# Altium project PCB_Project.PrjPcb
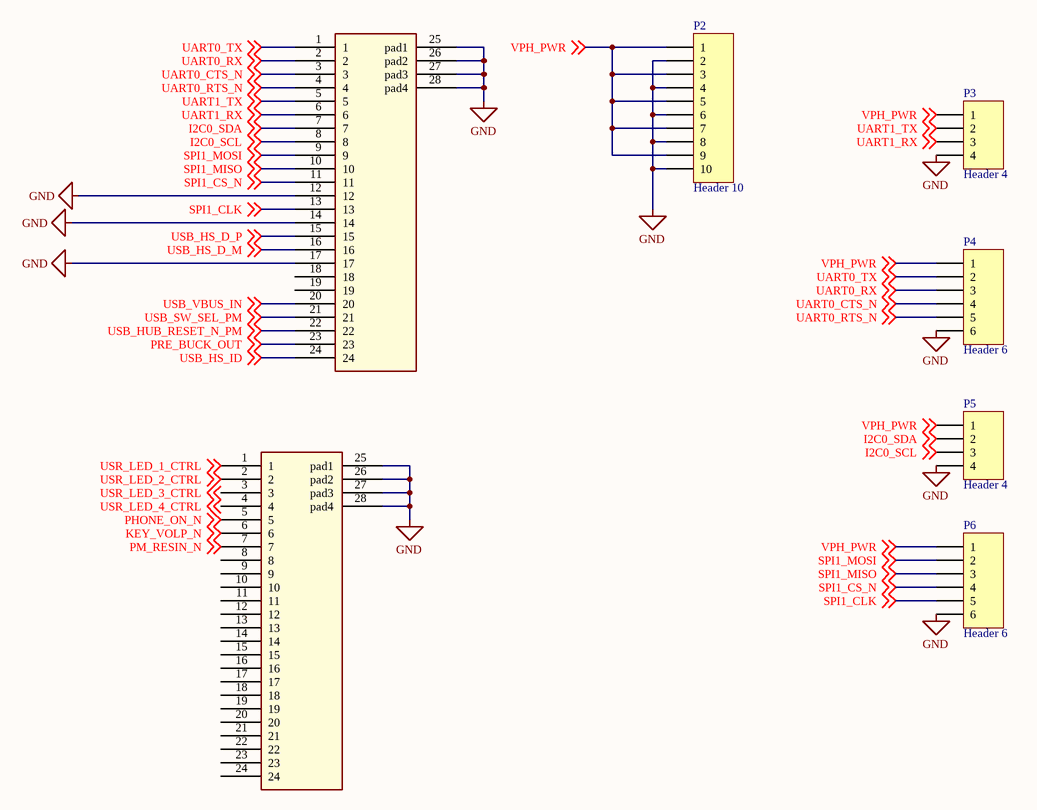
[diagram p0: INTERFACE_PWR_LS_HS.SchDoc]
3 sheets, 106 parts. Net scope: global (net labels, ports and power ports of the same name join across sheets).
Sheets:
  INTERFACE_PWR_LS_HS.SchDoc
  PWR_BUCK.SchDoc
  USB_HUB.SchDoc

## Sheet INTERFACE_PWR_LS_HS.SchDoc
size A4

### Parts
CN1  CON24_0  (value not drawn)
CN2  CON24_0  (value not drawn)
P2  Header 10  [HDR1X10]
P3  Header 4  [HDR1X4]
P4  Header 6  [HDR1X6]
P5  Header 4  [HDR1X4]
P6  Header 6  [HDR1X6]

### Nets
GND: CN1.12 CN1.14 CN1.17 CN1.25(pad1) CN1.26(pad2) CN1.27(pad3) CN1.28(pad4) CN2.25(pad1) CN2.26(pad2) CN2.27(pad3) CN2.28(pad4) P2.2 P2.4 P2.6 P2.8 P2.10 P3.4 P4.6 P5.4 P6.6
I2C0_SCL: CN1.8 P5.3 ; off-sheet I2C0_SCL
I2C0_SDA: CN1.7 P5.2 ; off-sheet I2C0_SDA
KEY_VOLP_N: CN2.6 ; off-sheet KEY_VOLP_N
PHONE_ON_N: CN2.5 ; off-sheet PHONE_ON_N
PM_RESIN_N: CN2.7 ; off-sheet PM_RESIN_N
PRE_BUCK_OUT: CN1.23 ; off-sheet PRE_BUCK_OUT
SPI1_CLK: CN1.13 P6.5 ; off-sheet SPI1_CLK
SPI1_CS_N: CN1.11 P6.4 ; off-sheet SPI1_CS_N
SPI1_MISO: CN1.10 P6.3 ; off-sheet SPI1_MISO
SPI1_MOSI: CN1.9 P6.2 ; off-sheet SPI1_MOSI
UART0_CTS_N: CN1.3 P4.4 ; off-sheet UART0_CTS_N
UART0_RTS_N: CN1.4 P4.5 ; off-sheet UART0_RTS_N
UART0_RX: CN1.2 P4.3 ; off-sheet UART0_RX
UART0_TX: CN1.1 P4.2 ; off-sheet UART0_TX
UART1_RX: CN1.6 P3.3 ; off-sheet UART1_RX
UART1_TX: CN1.5 P3.2 ; off-sheet UART1_TX
USB_HS_D_M: CN1.16 ; off-sheet USB_HS_D_M
USB_HS_D_P: CN1.15 ; off-sheet USB_HS_D_P
USB_HS_ID: CN1.24 ; off-sheet USB_HS_ID
USB_HUB_RESET_N_PM: CN1.22 ; off-sheet USB_HUB_RESET_N_PM
USB_SW_SEL_PM: CN1.21 ; off-sheet USB_SW_SEL_PM
USB_VBUS_IN: CN1.20 ; off-sheet USB_VBUS_IN
USR_LED_1_CTRL: CN2.1 ; off-sheet USR_LED_1_CTRL
USR_LED_2_CTRL: CN2.2 ; off-sheet USR_LED_2_CTRL
USR_LED_3_CTRL: CN2.3 ; off-sheet USR_LED_3_CTRL
USR_LED_4_CTRL: CN2.4 ; off-sheet USR_LED_4_CTRL
VPH_PWR: P2.1 P2.3 P2.5 P2.7 P2.9 P3.1 P4.1 P5.1 P6.1 ; off-sheet VPH_PWR

Not connected (* = marked no-connect by the designer): CN1 18 19; CN2 8 9 10 11 12 13 14 15 16 17 18 19 20 21 22 23 24

### Library data of the parts
P2 = Header 10: Header, 10-Pin; LatestRevisionDate: 17-Jul-2002; LatestRevisionNote: Re-released for DXP Platform.; Publisher: Altium Limited
P3 P5 = Header 4: Header, 4-Pin; LatestRevisionDate: 17-Jul-2002; LatestRevisionNote: Re-released for DXP Platform.; Publisher: Altium Limited
P4 P6 = Header 6: Header, 6-Pin; LatestRevisionDate: 17-Jul-2002; LatestRevisionNote: Re-released for DXP Platform.; Publisher: Altium Limited

## Sheet PWR_BUCK.SchDoc
size A4
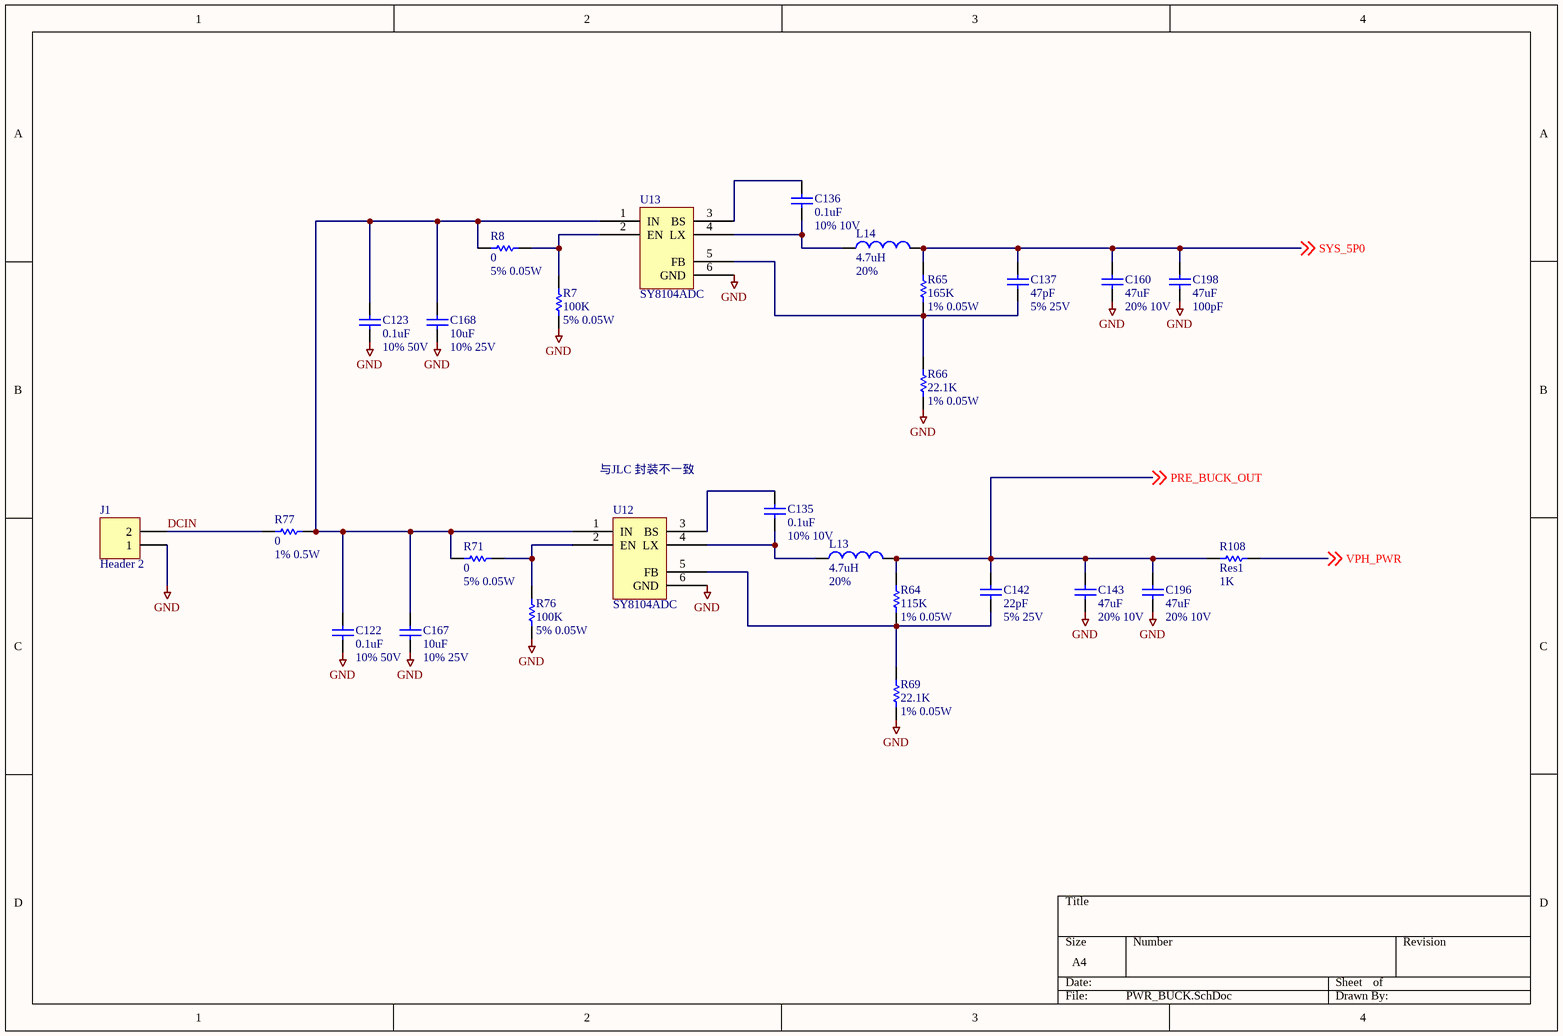
[diagram p1: PWR_BUCK.SchDoc]

### Parts
C122  0.1uF  value 10% 50V  [RAD-0.3]
C123  0.1uF  value 10% 50V  [RAD-0.3]
C135  0.1uF  value 10% 10V  [RAD-0.3]
C136  0.1uF  value 10% 10V  [RAD-0.3]
C137  47pF  value 5% 25V  [RAD-0.3]
C142  22pF  value 5% 25V  [RAD-0.3]
C143  47uF  value 20% 10V  [RAD-0.3]
C160  47uF  value 20% 10V  [RAD-0.3]
C167  10uF  value 10% 25V  [RAD-0.3]
C168  10uF  value 10% 25V  [RAD-0.3]
C196  47uF  value 20% 10V  [RAD-0.3]
C198  47uF  value 100pF  [RAD-0.3]
J1  Header 2  [HDR1X2]
L13  4.7uH  value 20%  [0402-A]
L14  4.7uH  value 20%  [0402-A]
R7  100K  value 5% 0.05W  [AXIAL-0.3]
R8  0  value 5% 0.05W  [AXIAL-0.3]
R64  115K  value 1% 0.05W  [AXIAL-0.3]
R65  165K  value 1% 0.05W  [AXIAL-0.3]
R66  22.1K  value 1% 0.05W  [AXIAL-0.3]
R69  22.1K  value 1% 0.05W  [AXIAL-0.3]
R71  0  value 5% 0.05W  [AXIAL-0.3]
R76  100K  value 5% 0.05W  [AXIAL-0.3]
R77  0  value 1% 0.5W  [AXIAL-0.3]
R108  Res1  value 1K  [AXIAL-0.3]
U12  SY8104ADC
U13  SY8104ADC

### Nets
GND: C122.1 C123.1 C143.1 C160.1 C167.1 C168.1 C196.1 C198.1 J1.1 R7.1 R66.1 R69.1 R76.1 U12.6(GND) U13.6(GND)
DCIN: J1.2 R77.1
PRE_BUCK_OUT: C142.2 C143.2 C196.2 L13.2 R64.2 R108.1 ; off-sheet PRE_BUCK_OUT
SYS_5P0: C137.2 C160.2 C198.2 L14.2 R65.2 ; off-sheet SYS_5P0
VPH_PWR: R108.2 ; off-sheet VPH_PWR
NetC122_2: C122.2 C123.2 C167.2 C168.2 R8.1 R71.1 R77.2 U12.1(IN) U13.1(IN)
NetC135_1: C135.1 L13.1 U12.4(LX)
NetC135_2: C135.2 U12.3(BS)
NetC136_1: C136.1 L14.1 U13.4(LX)
NetC136_2: C136.2 U13.3(BS)
NetC137_1: C137.1 R65.1 R66.2 U13.5(FB)
NetC142_1: C142.1 R64.1 R69.2 U12.5(FB)
NetR7_2: R7.2 R8.2 U13.2(EN)
NetR71_2: R71.2 R76.2 U12.2(EN)

### Notes on the sheet
- 与JLC 封装不一致

### Library data of the parts
C122 C123 C135-C137 C142 C143 C160 C167 C168 C196 C198 = Cap: Capacitor; Published: 8-Jun-2000; LatestRevisionDate: 17-Jul-2002; LatestRevisionNote: Re-released for DXP Platform.; PackageReference: RAD-0.3; Publisher: Altium Limited; PackageDescription: Radial Cap, Thru-Hole; 2 Leads; 0.3 in Pin Spacing
J1 = Header 2: Header, 2-Pin; LatestRevisionDate: 17-Jul-2002; LatestRevisionNote: Re-released for DXP Platform.; Publisher: Altium Limited
L13 L14 = Inductor: Code_IEC: 1005; Published: 8-Jun-2000; LatestRevisionDate: 29-May-2009; LatestRevisionNote: IPC-7351 Footprint Added.; PackageReference: 0402-A; Publisher: Altium Limited; PackageDescription: Chip Inductor; Code_JEITA: 0402
R7 R8 R64-R66 R69 R71 R76 R77 R108 = Res1: Resistor; Published: 8-Jun-2000; LatestRevisionDate: 17-Jul-2002; LatestRevisionNote: Re-released for DXP Platform.; PackageReference: AXIAL-0.3; Publisher: Altium Limited; PackageDescription: Axial Device, Thru-Hole; 2 Leads; 0.3 in Pin Spacing

## Sheet USB_HUB.SchDoc
size A0
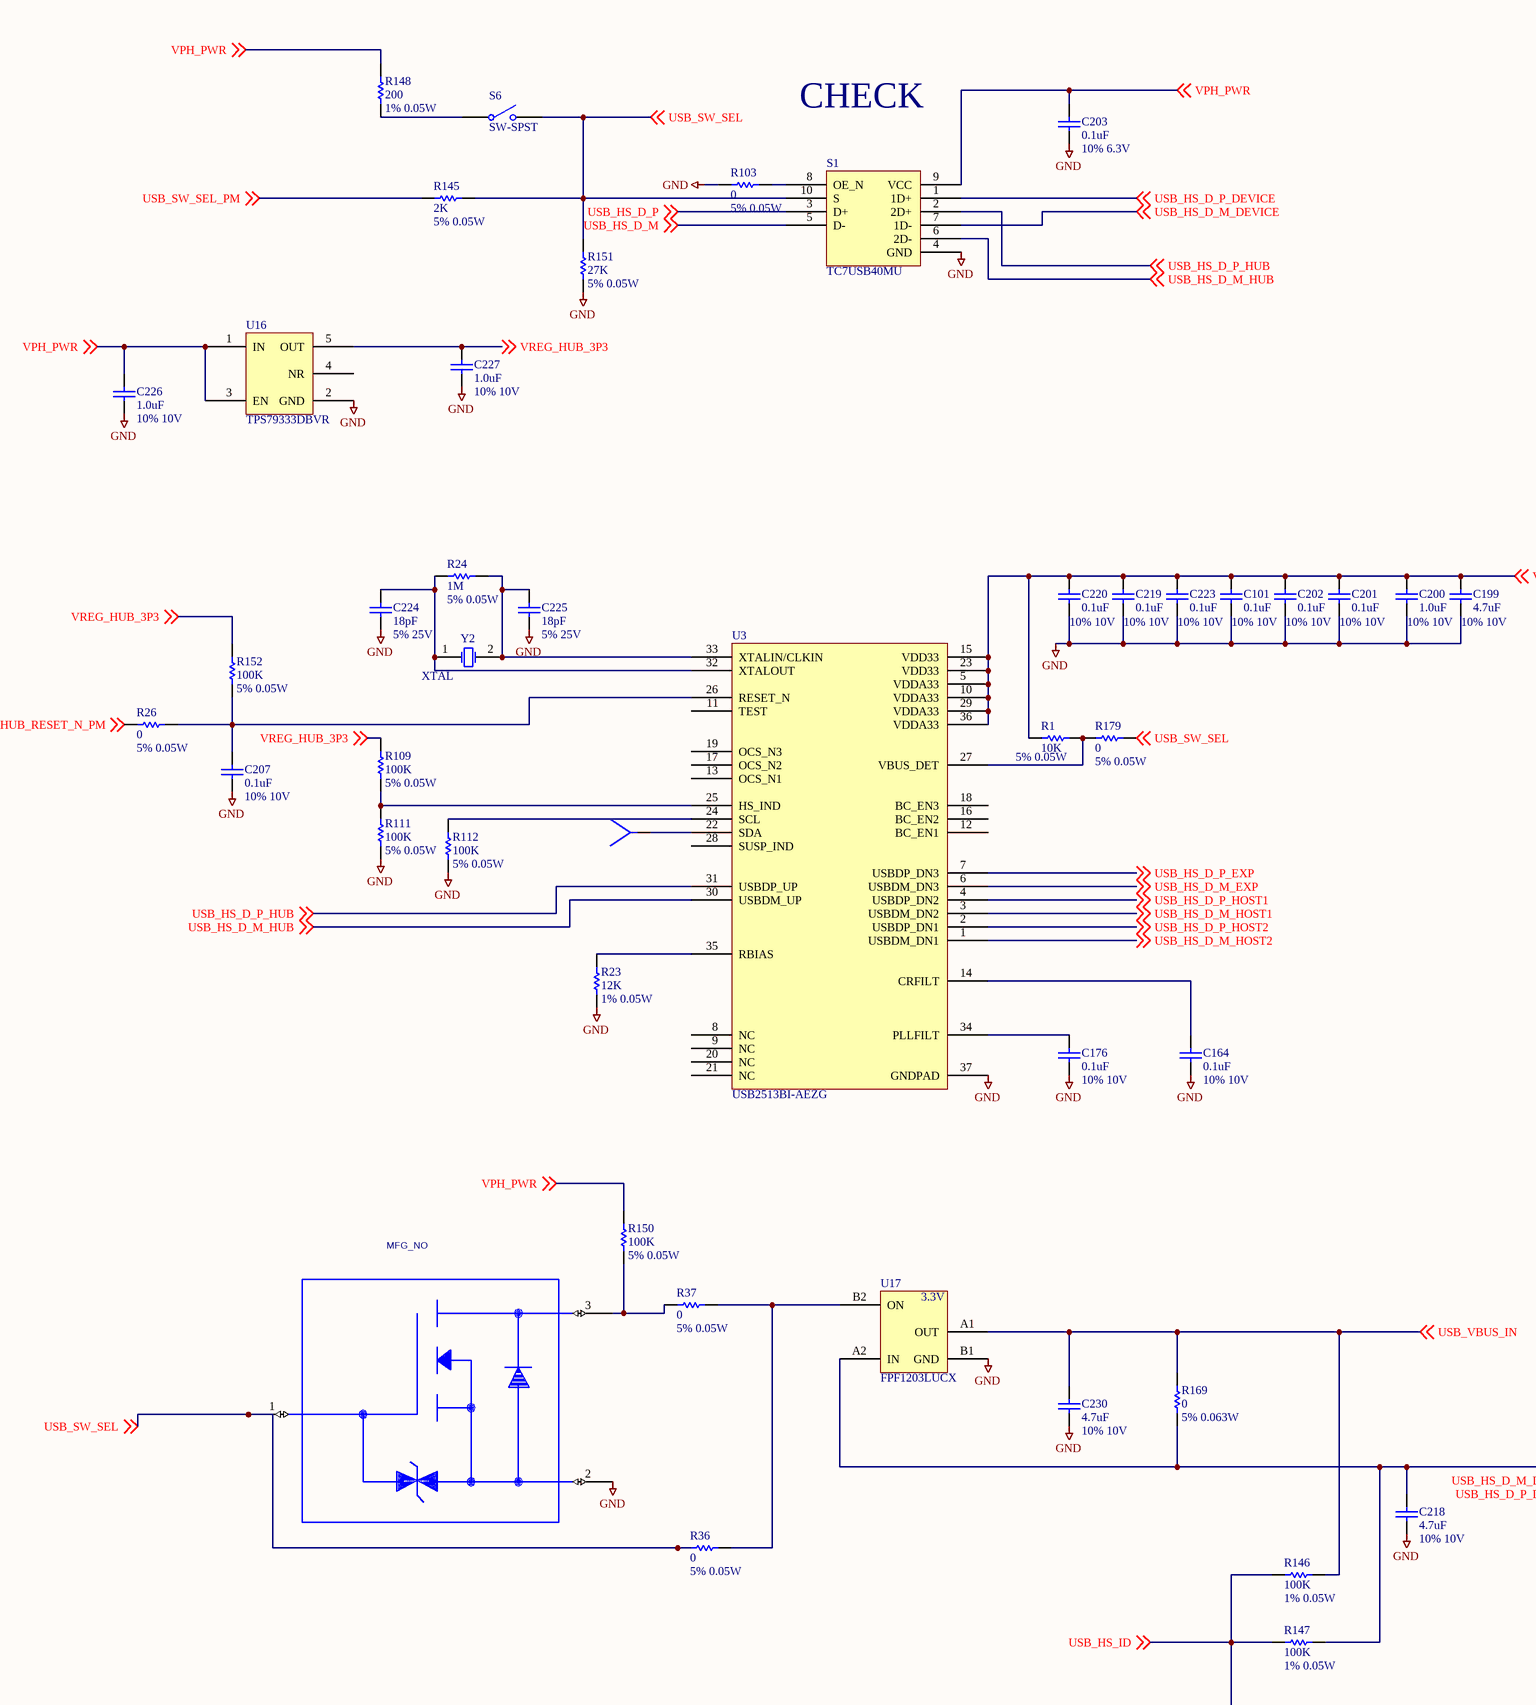
[diagram p2: USB_HUB.SchDoc, top left]
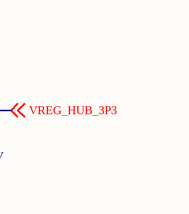
[diagram p3: USB_HUB.SchDoc, top right]
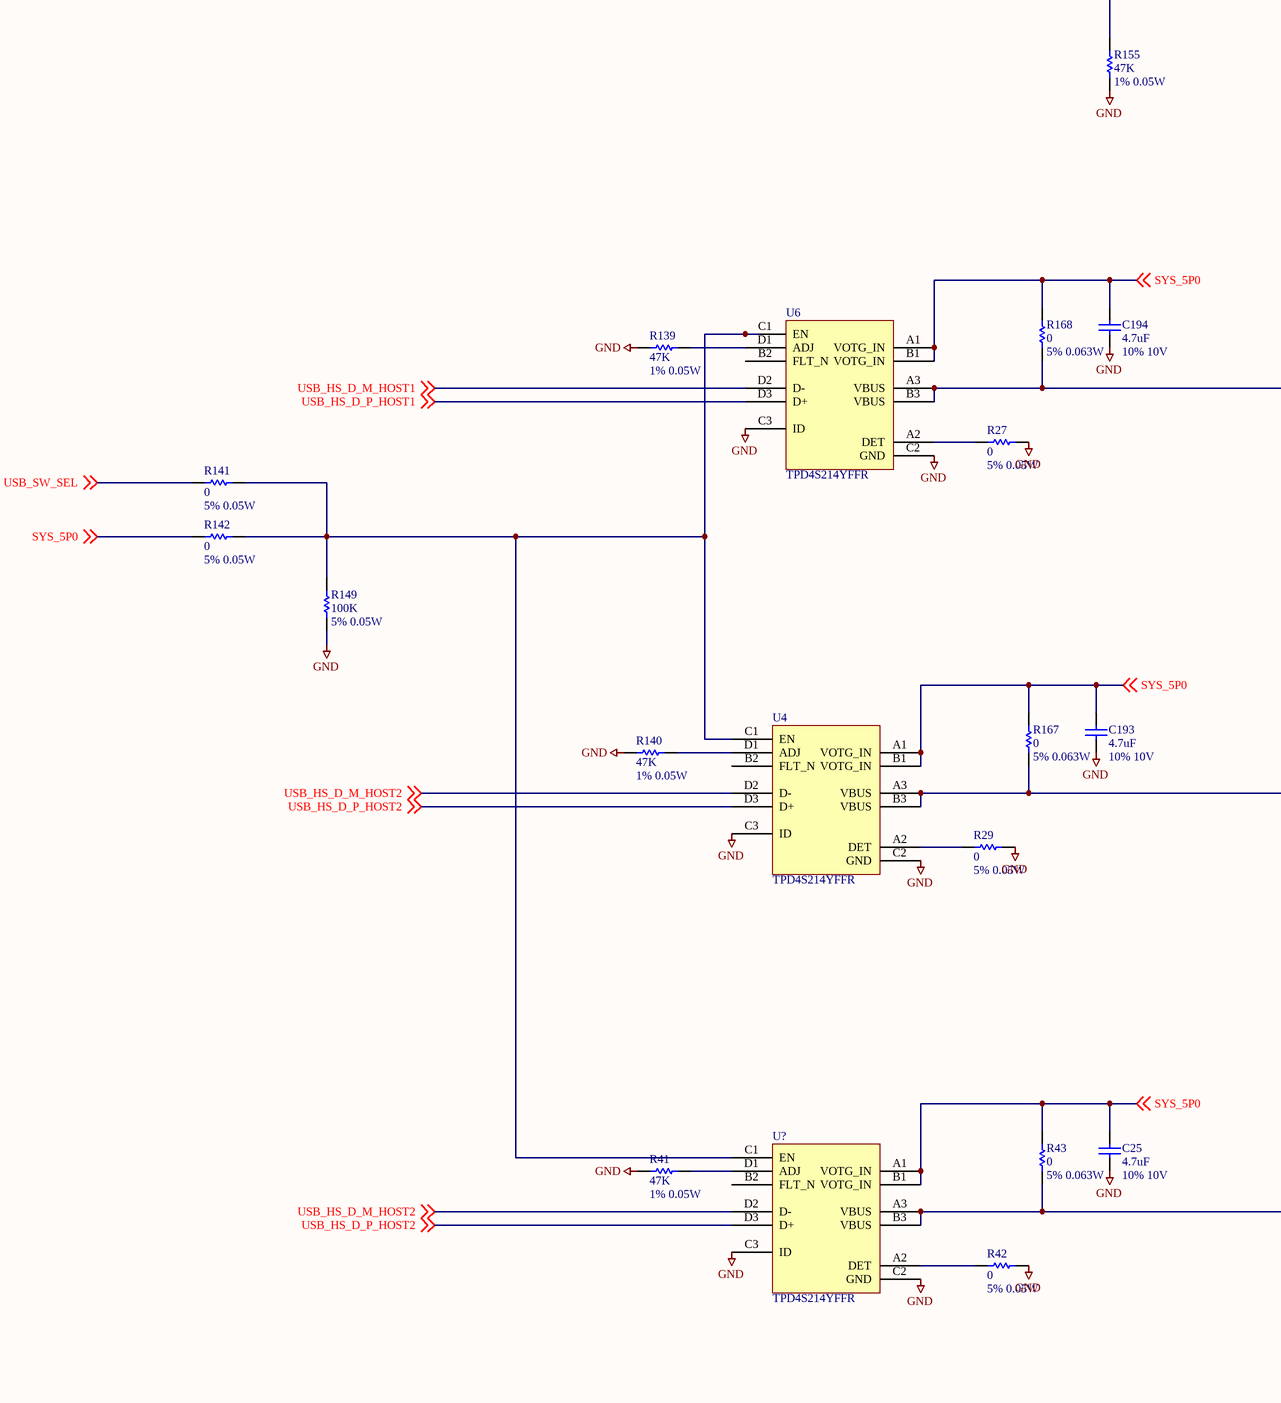
[diagram p4: USB_HUB.SchDoc, bottom left]
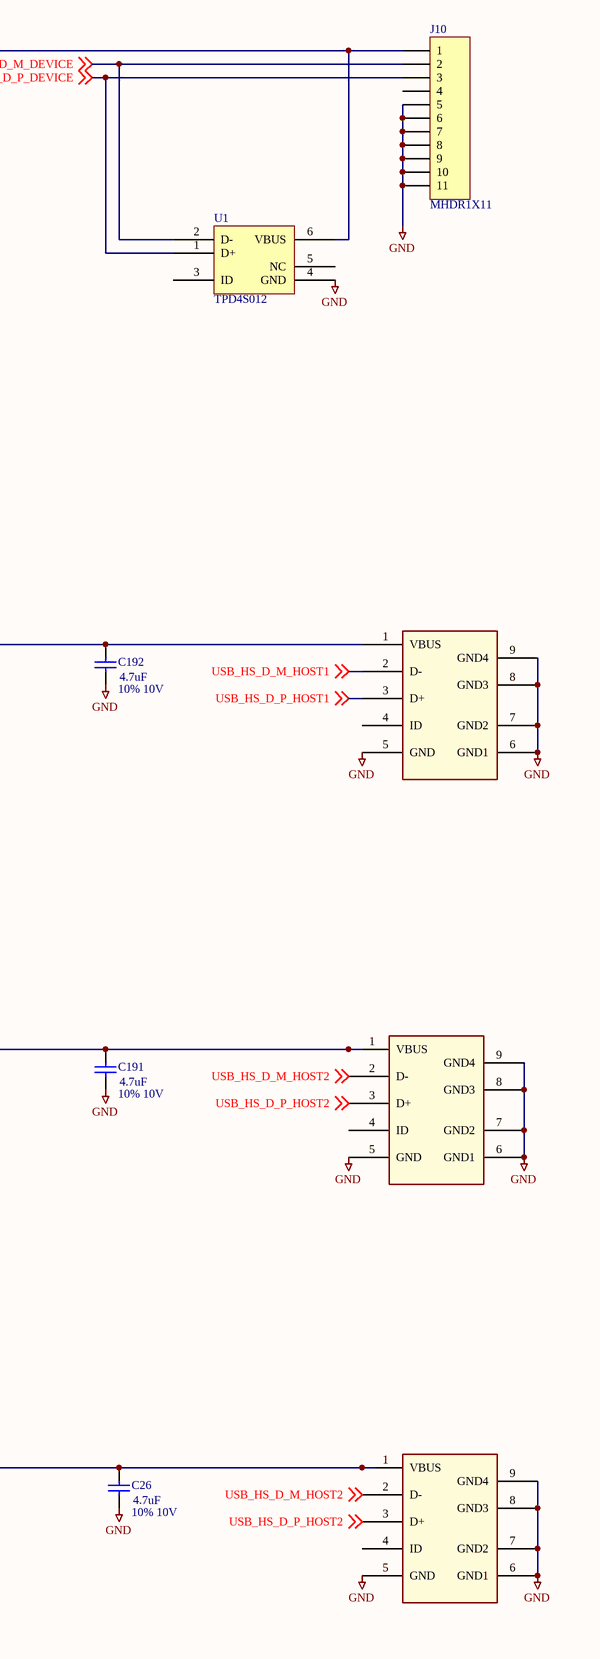
[diagram p5: USB_HUB.SchDoc, bottom right]

### Parts
C25  4.7uF  value 10% 10V  [RAD-0.3]
C26  4.7uF  value 10% 10V  [RAD-0.3]
C101  0.1uF  value 10% 10V  [RAD-0.3]
C164  0.1uF  value 10% 10V  [RAD-0.3]
C176  0.1uF  value 10% 10V  [RAD-0.3]
C191  4.7uF  value 10% 10V  [RAD-0.3]
C192  4.7uF  value 10% 10V  [RAD-0.3]
C193  4.7uF  value 10% 10V  [RAD-0.3]
C194  4.7uF  value 10% 10V  [RAD-0.3]
C199  4.7uF  value 10% 10V  [RAD-0.3]
C200  1.0uF  value 10% 10V  [RAD-0.3]
C201  0.1uF  value 10% 10V  [RAD-0.3]
C202  0.1uF  value 10% 10V  [RAD-0.3]
C203  0.1uF  value 10% 6.3V  [RAD-0.3]
C207  0.1uF  value 10% 10V  [RAD-0.3]
C218  4.7uF  value 10% 10V  [RAD-0.3]
C219  0.1uF  value 10% 10V  [RAD-0.3]
C220  0.1uF  value 10% 10V  [RAD-0.3]
C223  0.1uF  value 10% 10V  [RAD-0.3]
C224  18pF  value 5% 25V  [RAD-0.3]
C225  18pF  value 5% 25V  [RAD-0.3]
C226  1.0uF  value 10% 10V  [RAD-0.3]
C227  1.0uF  value 10% 10V  [RAD-0.3]
C230  4.7uF  value 10% 10V  [RAD-0.3]
J2  USB_SOCKET  (value not drawn)
J3  USB_SOCKET  (value not drawn)
J10  MHDR1X11  [MHDR1X11]
J?  USB_SOCKET  (value not drawn)
Q?  PART_ID: MFG_NO  (hidden comment: nfet_zener_bidir)
R1  10K  value 5% 0.05W  [AXIAL-0.3]
R23  12K  value 1% 0.05W  [AXIAL-0.3]
R24  1M  value 5% 0.05W  [AXIAL-0.3]
R26  0  value 5% 0.05W  [AXIAL-0.3]
R27  0  value 5% 0.05W  [AXIAL-0.3]
R29  0  value 5% 0.05W  [AXIAL-0.3]
R36  0  value 5% 0.05W  [AXIAL-0.3]
R37  0  value 5% 0.05W  [AXIAL-0.3]
R41  47K  value 1% 0.05W  [AXIAL-0.3]
R42  0  value 5% 0.05W  [AXIAL-0.3]
R43  0  value 5% 0.063W  [AXIAL-0.3]
R103  0  value 5% 0.05W  [AXIAL-0.3]
R109  100K  value 5% 0.05W  [AXIAL-0.3]
R111  100K  value 5% 0.05W  [AXIAL-0.3]
R112  100K  value 5% 0.05W  [AXIAL-0.3]
R139  47K  value 1% 0.05W  [AXIAL-0.3]
R140  47K  value 1% 0.05W  [AXIAL-0.3]
R141  0  value 5% 0.05W  [AXIAL-0.3]
R142  0  value 5% 0.05W  [AXIAL-0.3]
R145  2K  value 5% 0.05W  [AXIAL-0.3]
R146  100K  value 1% 0.05W  [AXIAL-0.3]
R147  100K  value 1% 0.05W  [AXIAL-0.3]
R148  200  value 1% 0.05W  [AXIAL-0.3]
R149  100K  value 5% 0.05W  [AXIAL-0.3]
R150  100K  value 5% 0.05W  [AXIAL-0.3]
R151  27K  value 5% 0.05W  [AXIAL-0.3]
R152  100K  value 5% 0.05W  [AXIAL-0.3]
R155  47K  value 1% 0.05W  [AXIAL-0.3]
R167  0  value 5% 0.063W  [AXIAL-0.3]
R168  0  value 5% 0.063W  [AXIAL-0.3]
R169  0  value 5% 0.063W  [AXIAL-0.3]
R179  0  value 5% 0.05W  [AXIAL-0.3]
S1  TC7USB40MU
S6  SW-SPST  [SPST-2]
TP18  TP  (value not drawn)
U1  TPD4S012
U3  USB2513BI-AEZG
U4  TPD4S214YFFR
U6  TPD4S214YFFR
U16  TPS79333DBVR
U17  FPF1203LUCX
U?  TPD4S214YFFR
Y2  XTAL  [R38]

### Nets
GND: C25.1 C26.2 C101.1 C164.1 C176.1 C191.2 C192.2 C193.1 C194.1 C199.1 C200.1 C201.1 C202.1 C203.2 C207.1 C218.1 C219.1 C220.1 C223.1 C224.1 C225.1 C226.1 C227.1 C230.1 J2.5(GND) J2.6(GND1) J2.7(GND2) J2.8(GND3) J2.9(GND4) J3.5(GND) J3.6(GND1) J3.7(GND2) J3.8(GND3) J3.9(GND4) J10.5 J10.6 J10.7 J10.8 J10.9 J10.10 J10.11 J?.5(GND) J?.6(GND1) J?.7(GND2) J?.8(GND3) J?.9(GND4) Q?.2(S) R23.1 R27.2 R29.2 R41.1 R42.2 R103.1 R111.1 R112.1 R139.1 R140.1 R149.1 R151.1 R155.1 S1.4(GND) U1.4(GND) U3.37(GNDPAD) U4.C2(GND) U4.C3(ID) U6.C2(GND) U6.C3(ID) U16.2(GND) U17.B1(GND) U?.C2(GND) U?.C3(ID)
SYS_5P0: C25.2 C193.2 C194.2 R43.2 R142.1 R167.2 R168.2 U4.A1(VOTG_IN) U4.B1(VOTG_IN) U6.A1(VOTG_IN) U6.B1(VOTG_IN) U?.A1(VOTG_IN) U?.B1(VOTG_IN) ; off-sheet SYS_5P0
USB_HS_D_M: S1.5(D-) ; off-sheet USB_HS_D_M
USB_HS_D_M_DEVICE: J10.2 S1.7(1D-) U1.2(D-) ; off-sheet USB_HS_D_M_DEVICE
USB_HS_D_M_EXP: U3.6(USBDM_DN3) ; off-sheet USB_HS_D_M_EXP
USB_HS_D_M_HOST1: J2.2(D-) U3.3(USBDM_DN2) U6.D2(D-) ; off-sheet USB_HS_D_M_HOST1
USB_HS_D_M_HOST2: J3.2(D-) J?.2(D-) U3.1(USBDM_DN1) U4.D2(D-) U?.D2(D-) ; off-sheet USB_HS_D_M_HOST2
USB_HS_D_M_HUB: S1.6(2D-) U3.30(USBDM_UP) ; off-sheet USB_HS_D_M_HUB
USB_HS_D_P: S1.3(D+) ; off-sheet USB_HS_D_P
USB_HS_D_P_DEVICE: J10.3 S1.1(1D+) U1.1(D+) ; off-sheet USB_HS_D_P_DEVICE
USB_HS_D_P_EXP: U3.7(USBDP_DN3) ; off-sheet USB_HS_D_P_EXP
USB_HS_D_P_HOST1: J2.3(D+) U3.4(USBDP_DN2) U6.D3(D+) ; off-sheet USB_HS_D_P_HOST1
USB_HS_D_P_HOST2: J3.3(D+) J?.3(D+) U3.2(USBDP_DN1) U4.D3(D+) U?.D3(D+) ; off-sheet USB_HS_D_P_HOST2
USB_HS_D_P_HUB: S1.2(2D+) U3.31(USBDP_UP) ; off-sheet USB_HS_D_P_HUB
USB_HS_ID: R146.1 R147.1 R155.2 ; off-sheet USB_HS_ID
USB_HUB_RESET_N_PM: R26.1 ; off-sheet USB_HUB_RESET_N_PM
USB_SW_SEL: Q?.1(G) R36.1 R141.1 R145.2 R151.2 R179.1 S1.10(S) S6.2(NO) ; off-sheet USB_SW_SEL
USB_SW_SEL_PM: R145.1 ; off-sheet USB_SW_SEL_PM
USB_VBUS_IN: C230.2 R146.2 R169.2 U17.A1(OUT) ; off-sheet USB_VBUS_IN
VPH_PWR: C203.1 C226.2 R148.2 R150.2 S1.9(VCC) U16.1(IN) U16.3(EN) ; off-sheet VPH_PWR
VREG_HUB_3P3: C101.2 C199.2 C200.2 C201.2 C202.2 C219.2 C220.2 C223.2 C227.2 R1.2 R109.2 R152.2 U3.5(VDDA33) U3.10(VDDA33) U3.15(VDD33) U3.23(VDD33) U3.29(VDDA33) U3.36(VDDA33) U16.5(OUT) ; off-sheet VREG_HUB_3P3
NetC26_1: C26.1 J?.1(VBUS) R43.1 U?.A3(VBUS) U?.B3(VBUS)
NetC164_2: C164.2 U3.14(CRFILT)
NetC176_2: C176.2 U3.34(PLLFILT)
NetC191_1: C191.1 J3.1(VBUS) R167.1 U4.A3(VBUS) U4.B3(VBUS)
NetC192_1: C192.1 J2.1(VBUS) R168.1 U6.A3(VBUS) U6.B3(VBUS)
NetC207_2: C207.2 R26.2 R152.1 U3.26(RESET_N)
NetC218_2: C218.2 J10.1 R147.2 R169.1 U1.6(VBUS) U17.A2(IN)
NetC224_2: C224.2 R24.1 U3.32(XTALOUT) Y2.1(OSC1)
NetC225_2: C225.2 R24.2 U3.33(XTALIN/CLKIN) Y2.2(OSC2)
NetQ?_3: Q?.3(D) R37.1 R150.1
NetR1_1: R1.1 R179.2 U3.27(VBUS_DET)
NetR23_2: R23.2 U3.35(RBIAS)
NetR27_1: R27.1 U6.A2(DET)
NetR29_1: R29.1 U4.A2(DET)
NetR36_2: R36.2 R37.2 U17.B2(ON)
NetR41_2: R41.2 U?.D1(ADJ)
NetR42_1: R42.1 U?.A2(DET)
NetR103_2: R103.2 S1.8(OE_N)
NetR109_1: R109.1 R111.2 U3.25(HS_IND)
NetR112_2: R112.2 U3.24(SCL)
NetR139_2: R139.2 U6.D1(ADJ)
NetR140_2: R140.2 U4.D1(ADJ)
NetR141_2: R141.2 R142.2 R149.2 U4.C1(EN) U6.C1(EN) U?.C1(EN)
NetR148_1: R148.1 S6.1(COMMON)
NetTP18_1: TP18.1(IO1) U3.22(SDA)

Not connected (* = marked no-connect by the designer): J2 4(ID); J3 4(ID); J10 4; J? 4(ID); U1 3(ID) 5(NC); U3 8(NC) 9(NC) 11(TEST) 12(BC_EN1) 13(OCS_N1) 16(BC_EN2) 17(OCS_N2) 18(BC_EN3) 19(OCS_N3) 20(NC) 21(NC) 28(SUSP_IND); U4 B2(FLT_N); U6 B2(FLT_N); U16 4(NR); U? B2(FLT_N)

### Notes on the sheet
- CHECK
- (in symbol FPF1203LUCX) 3.3V

### Library data of the parts
C25 C26 C101 C164 C176 C191-C194 C199-C203 C207 C218-C220 C223-C227 C230 = Cap: Capacitor; Published: 8-Jun-2000; LatestRevisionDate: 17-Jul-2002; LatestRevisionNote: Re-released for DXP Platform.; PackageReference: RAD-0.3; Publisher: Altium Limited; PackageDescription: Radial Cap, Thru-Hole; 2 Leads; 0.3 in Pin Spacing
J10 = MHDR1X11: Header, 11-Pin; LatestRevisionDate: 17-Jul-2002; LatestRevisionNote: Re-released for DXP Platform.; Publisher: Altium Limited
Q? = NFET_ZENER_BIDIR: PART_NUMBER: MCN_NO; OriginalSymbolOrigin: (-525,450); CDS_LMAN_SYM_OUTLINE: -475,450,475,-450; SYMNAME: nfet_zener_bidir; PACK_TYPE: ?
R1 R23 R24 R26 R27 R29 R36 R37 R41-R43 R103 R109 R111 R112 R139-R142 R145-R152 R155 R167-R169 R179 = Res1: Resistor; Published: 8-Jun-2000; LatestRevisionDate: 17-Jul-2002; LatestRevisionNote: Re-released for DXP Platform.; PackageReference: AXIAL-0.3; Publisher: Altium Limited; PackageDescription: Axial Device, Thru-Hole; 2 Leads; 0.3 in Pin Spacing
S6 = SW-SPST: Single-Pole, Single-Throw Switch; Published: 24-Mar-1999; LatestRevisionDate: 17-Jul-2002; LatestRevisionNote: Re-released for DXP Platform.; PackageReference: SPST-2; Publisher: Altium Limited; PackageDescription: Switch; 2 Leads
TP18 = TP_Dup1: PART_NUMBER: MCN_NO; PART_ID: MFG_NO; OriginalSymbolOrigin: (-50,75); CDS_LMAN_SYM_OUTLINE: -50,75,50,0; SYMNAME: TP; PACK_TYPE: TP
Y2 = XTAL: Crystal Oscillator; Published: 8-Jun-2000; LatestRevisionDate: 17-Jul-2002; LatestRevisionNote: Re-released for DXP Platform.; PackageReference: R38; Publisher: Altium Limited; PackageDescription: Crystal, Thru-Hole; 2 Leads; Body 3.1 x 8.2 mm (Dia.xH)

## Nets that join several sheets
GND: INTERFACE_PWR_LS_HS (20 pins), PWR_BUCK (15 pins), USB_HUB (71 pins)
PRE_BUCK_OUT: INTERFACE_PWR_LS_HS (CN1.23), PWR_BUCK (6 pins)
SYS_5P0: PWR_BUCK (5 pins), USB_HUB (13 pins)
USB_HS_D_M: INTERFACE_PWR_LS_HS (CN1.16), USB_HUB (S1.5)
USB_HS_D_P: INTERFACE_PWR_LS_HS (CN1.15), USB_HUB (S1.3)
USB_HS_ID: INTERFACE_PWR_LS_HS (CN1.24), USB_HUB (R146.1 R147.1 R155.2)
USB_HUB_RESET_N_PM: INTERFACE_PWR_LS_HS (CN1.22), USB_HUB (R26.1)
USB_SW_SEL_PM: INTERFACE_PWR_LS_HS (CN1.21), USB_HUB (R145.1)
USB_VBUS_IN: INTERFACE_PWR_LS_HS (CN1.20), USB_HUB (C230.2 R146.2 R169.2 U17.A1)
VPH_PWR: INTERFACE_PWR_LS_HS (9 pins), PWR_BUCK (R108.2), USB_HUB (7 pins)